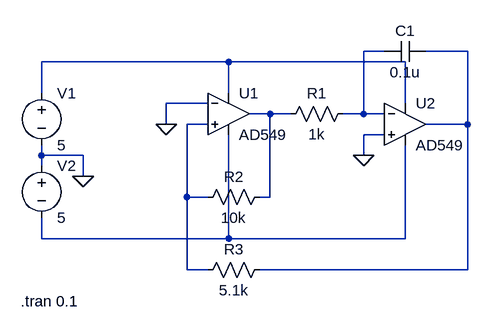
[diagram p0: schematic TriangleWave.asc]
TriangleWave.asc, the LTspice schematic file:
Version 4
SHEET 1 880 680
WIRE 368 16 336 16
WIRE 496 16 432 16
WIRE 128 32 -160 32
WIRE 400 32 128 32
WIRE -160 80 -160 32
WIRE 128 80 128 32
WIRE 96 96 32 96
WIRE 400 96 400 32
WIRE 192 112 160 112
WIRE 224 112 192 112
WIRE 336 112 336 16
WIRE 336 112 304 112
WIRE 368 112 336 112
WIRE 32 128 32 96
WIRE 96 128 64 128
WIRE 496 128 496 16
WIRE 496 128 432 128
WIRE 368 144 336 144
WIRE -160 176 -160 160
WIRE -96 176 -160 176
WIRE 336 176 336 144
WIRE -160 192 -160 176
WIRE -96 208 -96 176
WIRE 64 240 64 128
WIRE 96 240 64 240
WIRE 192 240 192 112
WIRE 192 240 176 240
WIRE -160 304 -160 272
WIRE 128 304 128 144
WIRE 128 304 -160 304
WIRE 400 304 400 160
WIRE 400 304 128 304
WIRE 64 352 64 240
WIRE 96 352 64 352
WIRE 496 352 496 128
WIRE 496 352 176 352
FLAG 32 128 0
FLAG 336 176 0
FLAG -96 208 0
SYMBOL Opamps\\AD549 128 48 R0
SYMATTR InstName U1
SYMBOL Opamps\\AD549 400 64 R0
SYMATTR InstName U2
SYMBOL res 320 96 R90
WINDOW 0 0 56 VBottom 2
WINDOW 3 32 56 VTop 2
SYMATTR InstName R1
SYMATTR Value 1k
SYMBOL res 192 224 R90
WINDOW 0 0 56 VBottom 2
WINDOW 3 32 56 VTop 2
SYMATTR InstName R2
SYMATTR Value 10k
SYMBOL res 192 336 R90
WINDOW 0 0 56 VBottom 2
WINDOW 3 32 56 VTop 2
SYMATTR InstName R3
SYMATTR Value 5.1k
SYMBOL cap 432 0 R90
WINDOW 0 0 32 VBottom 2
WINDOW 3 32 32 VTop 2
SYMATTR InstName C1
SYMATTR Value 0.1u
SYMBOL voltage -160 64 R0
WINDOW 123 0 0 Left 0
WINDOW 39 0 0 Left 0
SYMATTR InstName V1
SYMATTR Value 5
SYMBOL voltage -160 176 R0
WINDOW 123 0 0 Left 0
WINDOW 39 0 0 Left 0
SYMATTR InstName V2
SYMATTR Value 5
TEXT -192 400 Left 2 !.tran 0.1

The netlist it stands for:
* TriangleWave.asc
XU1 N005 0 N003 N006 N004 AD549  ; pins In+ In- V+ V- OUT
XU2 0 N001 N003 N006 N002 AD549  ; pins In+ In- V+ V- OUT
R1 N001 N004 1k
R2 N004 N005 10k
R3 N002 N005 5.1k
C1 N002 N001 0.1u
V1 N003 0 5
V2 0 N006 5
.tran 0.1
.backanno
.end